# Altium schematic sheet Fujin_Connectors.SchDoc
size A4; SheetNumber: 4; SheetTotal: 4
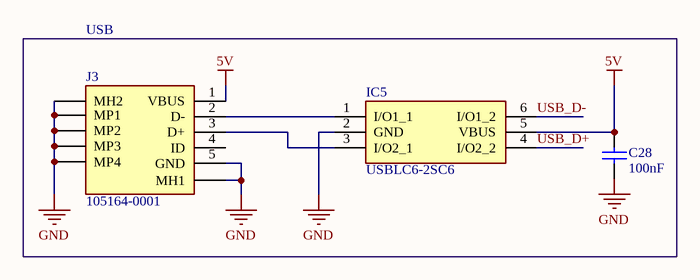
[diagram p0: Fujin_Connectors.SchDoc]

## Parts
C28  100nF  [CAP 0402]
IC5  USBLC6-2SC6  [SOT95P280X145-6N]
J3  105164-0001  [1051640001]

## Blocks framed on the sheet
USB: C28 IC5 J3

## Nets
5V: C28.2 IC5.5(VBUS) J3.1(VBUS)
GND: C28.1 IC5.2(GND) J3.5(GND) J3.MH1 J3.MH2 J3.MP1 J3.MP2 J3.MP3 J3.MP4
USB_D+: IC5.4(I/O2_2)
USB_D-: IC5.6(I/O1_2)
NetIC5_1: IC5.1(I/O1_1) J3.2(D-)
NetIC5_3: IC5.3(I/O2_1) J3.3(D+)

Not connected (* = marked no-connect by the designer): J3 4(ID)

## Library data of the parts
C28 = CAP 100NF 50V 0402: Capacitor Cer 100nF 50V 0402; Manufacturer Part Number: IMP14925; Product Range: MCFY Series; Capacitance: 0.1uF; Capacitance Tolerance: +80%, -20%; Dielectric Characteristic: Y5; Voltage Rating: 50; Capacitor Terminals: Radial Leaded; SVHC: No SVHC (15-Jun-2015); Supplier 1: Mult Comercial; Manufacturer: -; RoHS: YES; Stock 1: 115809; Pricing 1: 1=0.10 (BRL); Packaging: Each; Lead Spacing: 5; Operating Temperature Min: -25; Operating Temperature Max: 85; Capacitance Tolerance ±: +80%, -20%; Operating Temperature Range: -25°C to +85°C<!--FANDB--><div class="features-and-benefits-container"><div class="features-and-benefits-description"><span class="features-benefits-value">The MCFY series from Multicomp are radial leaded ceramic disc capacitors. The capacitance values ranges from 6800pF to 0.22?F.</span></div><div class="features-and-benefits-list"><ul class="features-and-benefits-list-list"><li class="features-and-benefits-list-item">Large capacitance in small size</li><li class="features-and-benefits-list-item">Rated voltage of 50V</li><li class="features-and-benefits-list-item">80%/-20% tolerance</li><li class="features-and-benefits-list-item">Operating temperature range -25°C to +85; ComponentLink1URL: http://loja.multcomercial.com.br/capacitor-ceramico-disco-100kpf-50v-104-100k-100nf-0-1uf-cod-1351.html; ComponentLink1Description: http://loja.multcomercial.com.br/capacitor-ceramico-disco-100kpf-50v-104-100k-100nf-0-1uf-cod-1351.html; Supplier Part Number 1: Capacitor Cerâmico Disco 100Kpf/50V (104/100K/100nF/0.1uF) cód. 1351
IC5 = USBLC6-2SC6: Integrated Circuit; Manufacturer_Name: STMicroelectronics; Datasheet Link: http://www.st.com/st-web-ui/static/active/en/resource/technical/document/datasheet/CD00050750.pdf; Height: 1.45mm; Manufacturer_Part_Number: USBLC6-2SC6; Mouser Part Number: 511-USBLC6-2SC6; Mouser Price/Stock: https://www.mouser.co.uk/ProductDetail/STMicroelectronics/USBLC6-2SC6?qs=po45yt2pPpu%2FhNIlwQdTlg%3D%3D; Arrow Part Number: USBLC6-2SC6; Arrow Price/Stock: https://www.arrow.com/en/products/usblc6-2sc6/stmicroelectronics?region=nac
J3 = 105164-0001: Connector; Manufacturer_Name: Molex; Datasheet Link: https://www.molex.com/pdm_docs/sd/1051640001_sd.pdf; Height: 2.7mm; Manufacturer_Part_Number: 105164-0001; Mouser Part Number: 538-105164-0001; Mouser Price/Stock: https://www.mouser.co.uk/ProductDetail/Molex/105164-0001?qs=JAwGc6FMfvtRY4SkW%2FoGcQ%3D%3D